# Altium schematic sheet DPPXHK_SERVO.SCHDOC
size A4
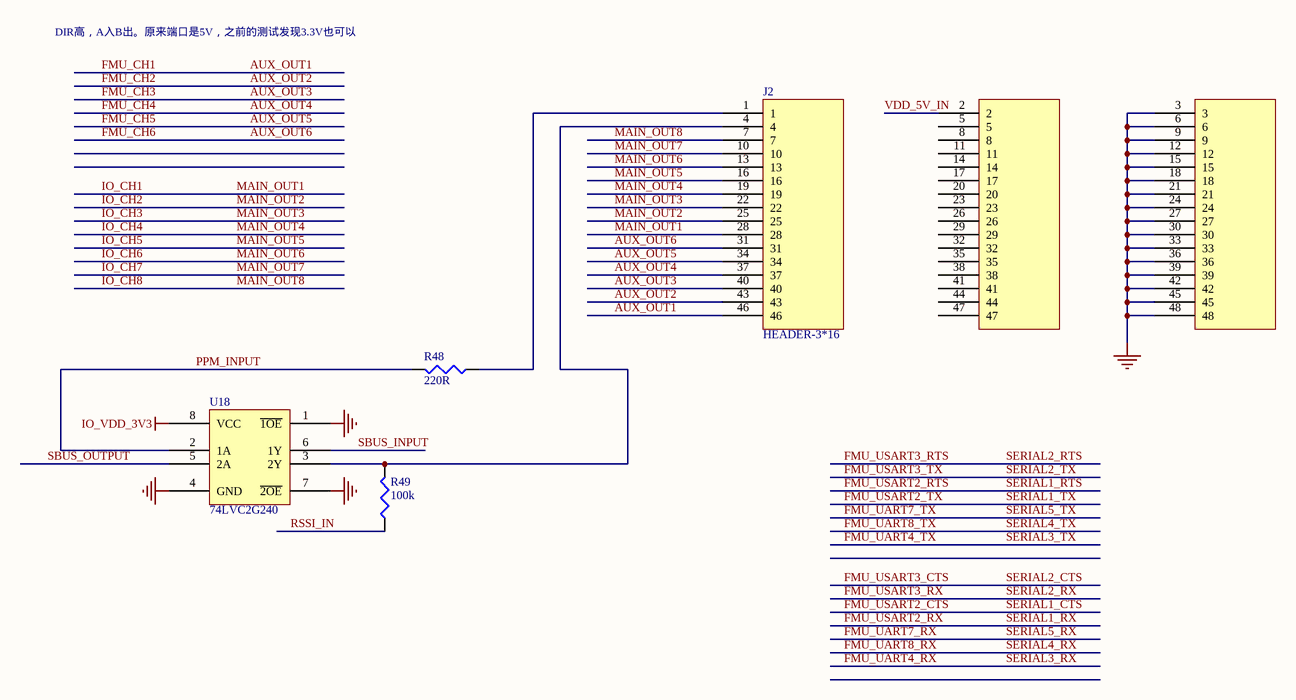
[diagram p0: DPPXHK_SERVO.SCHDOC]

## Parts
J2  HEADER-3*16  [3X16RA]
R48  220R  [0402R]
R49  100k  [0402R]
U18  74LVC2G240  [TSSOP_8]

## Nets
GND: J2.3 J2.6 J2.9 J2.12 J2.15 J2.18 J2.21 J2.24 J2.27 J2.30 J2.33 J2.36 J2.39 J2.42 J2.45 J2.48 U18.1(~{1OE}) U18.4(GND) U18.7(~{2OE})
IO_VDD_3V3: U18.8(VCC)
AUX_OUT1: J2.46  [also labelled FMU_CH1]
AUX_OUT2: J2.43  [also labelled FMU_CH2]
AUX_OUT3: J2.40  [also labelled FMU_CH3]
AUX_OUT4: J2.37  [also labelled FMU_CH4]
AUX_OUT5: J2.34  [also labelled FMU_CH5]
AUX_OUT6: J2.31  [also labelled FMU_CH6]
IO_CH1: J2.28  [also labelled MAIN_OUT1]
IO_CH2: J2.25  [also labelled MAIN_OUT2]
IO_CH3: J2.22  [also labelled MAIN_OUT3]
IO_CH4: J2.19  [also labelled MAIN_OUT4]
IO_CH5: J2.16  [also labelled MAIN_OUT5]
IO_CH6: J2.13  [also labelled MAIN_OUT6]
IO_CH7: J2.10  [also labelled MAIN_OUT7]
IO_CH8: J2.7  [also labelled MAIN_OUT8]
PPM_INPUT: R48.2 U18.2(1A)
RSSI_IN: R49.1
SBUS_INPUT: U18.6(1Y)
SBUS_OUTPUT: U18.5(2A)
VDD_5V_IN: J2.2
NetJ2_1: J2.1 R48.1
NetJ2_4: J2.4 R49.2 U18.3(2Y)

Not connected (* = marked no-connect by the designer): J2 5 8 11 14 17 20 23 26 29 32 35 38 41 44 47

## Notes on the sheet
- DIR高，A入B出。原来端口是5V，之前的测试发现3.3V也可以

## Library data of the parts
R48 R49 = Res3: Resistor; Published: 8-Jun-2000; LatestRevisionDate: 4-Mar-2005; LatestRevisionNote: PCB Footprint replaced.; Publisher: Altium Limited